# EAGLE design gsm (EAGLE 7.5.0)
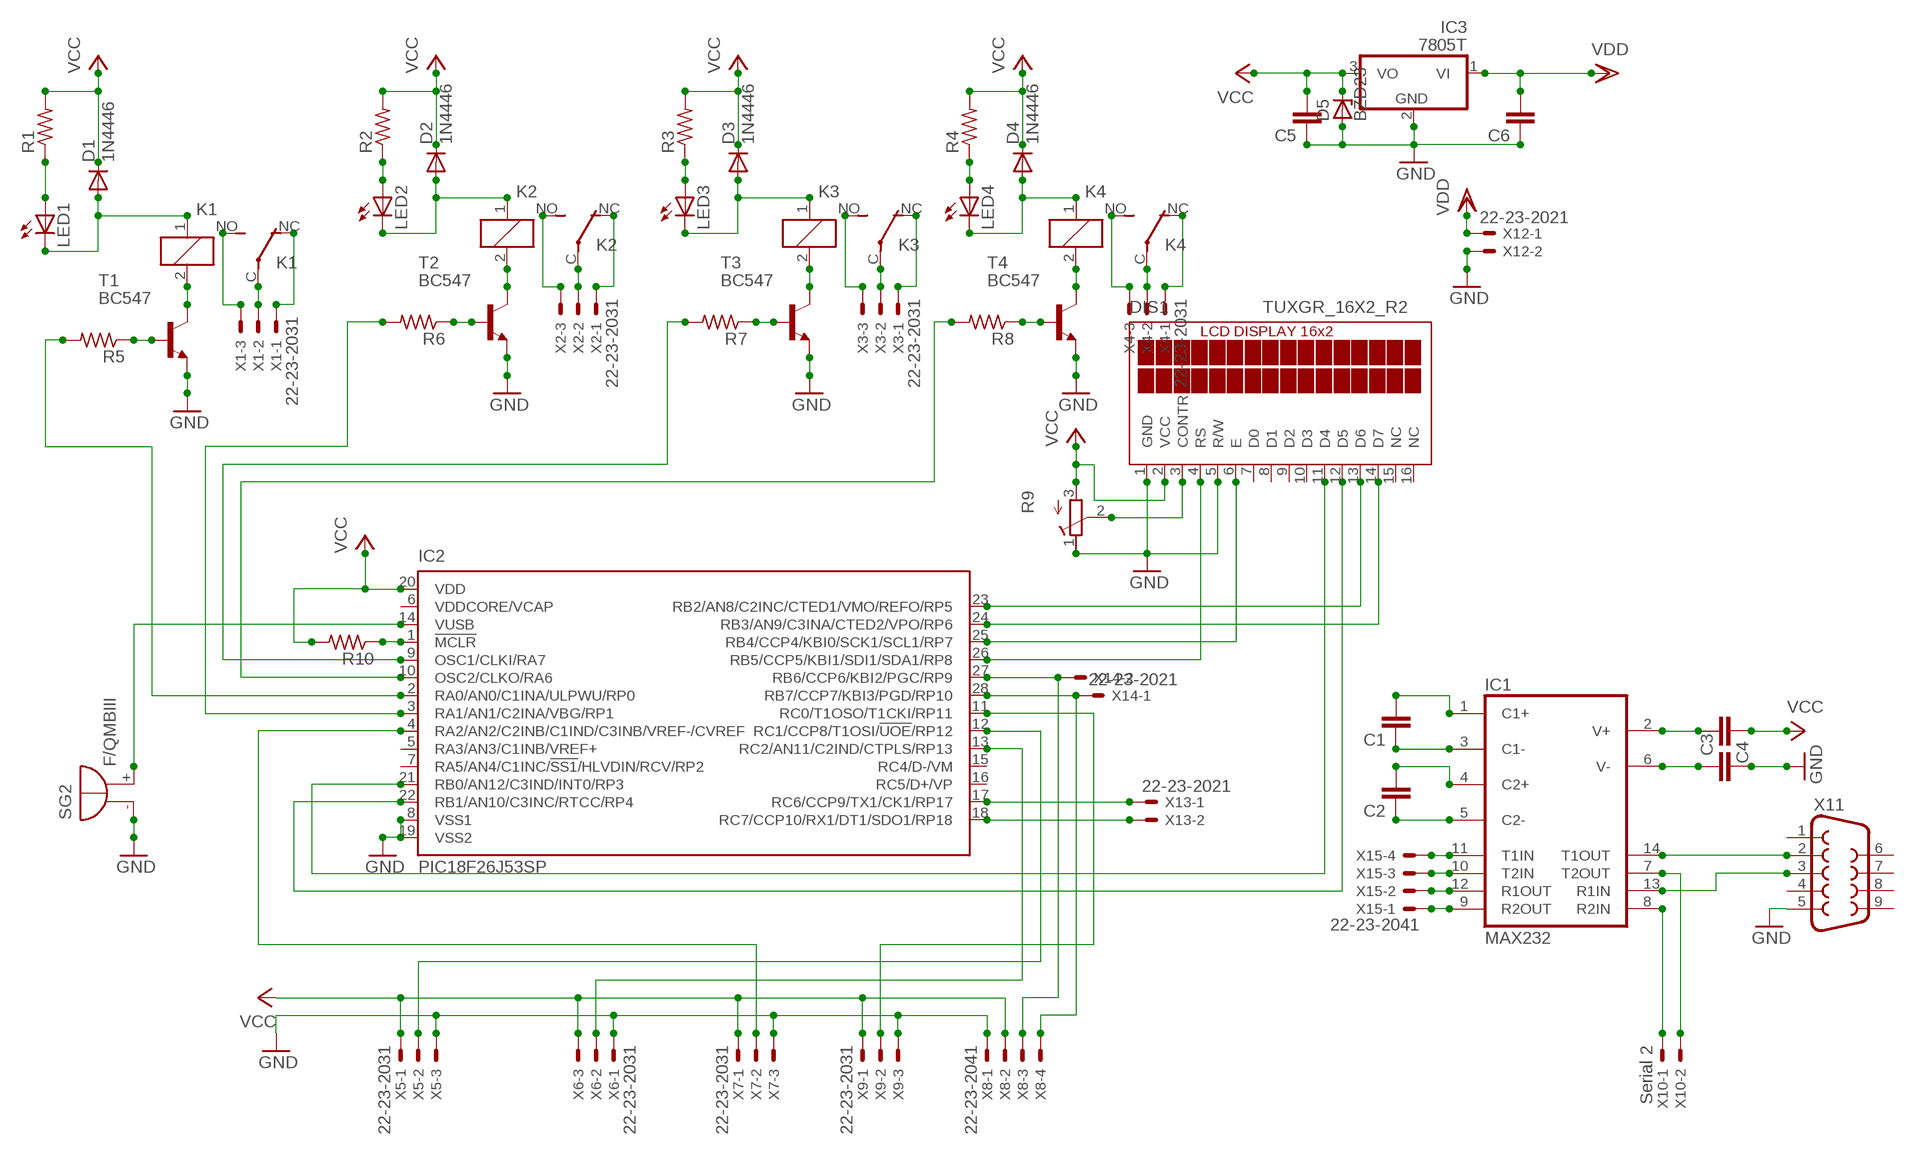
[diagram p0: schematic, sheet 1]

## Parts
C1  C2.5/2  [C2.5-2]
C2  C2.5/2  [C2.5-2]
C3  C2.5/2  [C2.5-2]
C4  C2.5/2  [C2.5-2]
C5  C2.5/2  [C2.5-2]
C6  C2.5/2  [C2.5-2]
D1  1N4446  [DO35-10]
D2  1N4446  [DO35-10]
D3  1N4446  [DO35-10]
D4  1N4446  [DO35-10]
D5  BZD23  [SOD81]
DIS1  TUXGR_16X2_R2  [TUXGR_16X2_R2]
IC1  MAX232  [DIL16]
IC2  PIC18F26J53SP  [DIL28-3]
IC3  7805T  [TO220H]
K1  JJM1-12V  [JJM1C]
K2  JJM1-12V  [JJM1C]
K3  JJM1-12V  [JJM1C]
K4  JJM1-12V  [JJM1C]
LED1  LED3MM  [LED3MM]
LED2  LED3MM  [LED3MM]
LED3  LED3MM  [LED3MM]
LED4  LED3MM  [LED3MM]
R1  R-US_0207/10  [0207/10]
R2  R-US_0207/10  [0207/10]
R3  R-US_0207/10  [0207/10]
R4  R-US_0207/10  [0207/10]
R5  R-US_0207/10  [0207/10]
R6  R-US_0207/10  [0207/10]
R7  R-US_0207/10  [0207/10]
R8  R-US_0207/10  [0207/10]
R9  R-TRIMMT93YA  [RTRIMT93YA]
R10  R-US_0207/10  [0207/10]
SG2  F/QMBIII  [F/QMBIII]
T1  BC547  [TO92]
T2  BC547  [TO92]
T3  BC547  [TO92]
T4  BC547  [TO92]
X1  22-23-2031  [22-23-2031]
X2  22-23-2031  [22-23-2031]
X3  22-23-2031  [22-23-2031]
X4  22-23-2031  [22-23-2031]
X5  22-23-2031  [22-23-2031]
X6  22-23-2031  [22-23-2031]
X7  22-23-2031  [22-23-2031]
X8  22-23-2041  [22-23-2041]
X9  22-23-2031  [22-23-2031]
X10  Serial 2  22-23-2021  [22-23-2021]
X11  F09H  [F09H]
X12  22-23-2021  [22-23-2021]
X13  22-23-2021  [22-23-2021]
X14  22-23-2021  [22-23-2021]
X15  22-23-2041  [22-23-2041]

## Nets
FIRERELAY: IC2.2(RA0/AN0/C1INA/ULPWU/RP0) R5.2
GND: C3.2 C5.1 C6.1 D5.A DIS1.1(GND) DIS1.5(R/W) IC2.8(VSS1) IC2.19(VSS2) IC3.2(GND) R9.1(E) SG2.-(+) T1.1(E) T2.1(E) T3.1(E) T4.1(E) X5.3 X6.1 X7.3 X8.1 X9.3 X11.5 X12.2
N$1: K4.NC(2:O) X4.1
N$2: LED1.A R1.1
N$3: D1.A K1.1 LED1.K(C)
N$4: K4.C(2:P) X4.2
N$5: LED2.A R2.1
N$6: D2.A K2.1 LED2.K(C)
N$7: K4.NO(2:S) X4.3
N$8: LED3.A R3.1
N$9: D3.A K3.1 LED3.K(C)
N$10: K3.NC(2:O) X3.1
N$11: LED4.A R4.1
N$12: D4.A K4.1 LED4.K(C)
N$13: K1.2 T1.3(C)
N$14: K2.2 T2.3(C)
N$15: K3.2 T3.3(C)
N$16: K4.2 T4.3(C)
N$17: R5.1 T1.2(B)
N$18: R6.1 T2.2(B)
N$19: R7.1 T3.2(B)
N$20: R8.1 T4.2(B)
N$21: IC2.3(RA1/AN1/C2INA/VBG/RP1) R6.2
N$22: IC2.9(OSC1/CLKI/RA7) R7.2
N$23: IC2.10(OSC2/CLKO/RA6) R8.2
N$24: DIS1.14(D7) IC2.24(RB3/AN9/C3INA/CTED2/VPO/RP6)
N$25: DIS1.13(D6) IC2.23(RB2/AN8/C2INC/CTED1/VMO/REFO/RP5)
N$26: DIS1.12(D5) IC2.22(RB1/AN10/C3INC/RTCC/RP4)
N$27: DIS1.11(D4) IC2.21(RB0/AN12/C3IND/INT0/RP3)
N$28: DIS1.6(E) IC2.25(RB4/CCP4/KBI0/SCK1/SCL1/RP7)
N$29: DIS1.4(RS) IC2.26(RB5/CCP5/KBI1/SDI1/SDA1/RP8)
N$30: DIS1.3(CONTR) R9.2(S)
N$31: K3.C(2:P) X3.2
N$32: K3.NO(2:S) X3.3
N$33: K2.C(2:P) X2.2
N$34: K2.NC(2:O) X2.1
N$35: K2.NO(2:S) X2.3
N$36: K1.C(2:P) X1.2
N$37: K1.NC(2:O) X1.1
N$38: K1.NO(2:S) X1.3
N$39: C1.2 IC1.1(C1+)
N$40: C1.1 IC1.3(C1-)
N$41: C2.2 IC1.4(C2+)
N$42: C2.1 IC1.5(C2-)
N$43: C4.2 IC1.2(V+)
N$44: C3.1 IC1.6(V-)
N$45: IC2.17(RC6/CCP9/TX1/CK1/RP17) X13.1
N$46: IC1.10(T2IN) X15.3
N$47: IC2.12(RC1/CCP8/T1OSI/!UOE!/RP12) X5.2
N$48: IC2.13(RC2/AN11/C2IND/CTPLS/RP13) X6.2
N$49: IC2.4(RA2/AN2/C2INB/C1IND/C3INB/VREF-/CVREF) X7.2
N$50: IC1.11(T1IN) X15.4
N$51: IC1.12(R1OUT) X15.2
N$52: IC2.27(RB6/CCP6/KBI2/PGC/RP9) X8.3 X14.2
N$53: IC2.1(!MCLR) R10.1
N$54: IC2.11(RC0/T1OSO/T1CKI/RP11) X9.2
N$55: IC2.14(VUSB) SG2.+(-)
N$56: IC2.28(RB7/CCP7/KBI3/PGD/RP10) X8.4 X14.1
N$61: IC1.13(R1IN) X11.3
N$62: IC1.14(T1OUT) X11.2
N$63: IC1.7(T2OUT) X10.2
N$64: IC1.8(R2IN) X10.1
N$66: IC2.18(RC7/CCP10/RX1/DT1/SDO1/RP18) X13.2
N$67: IC1.9(R2OUT) X15.1
VCC: C4.1 C5.2 D1.C D2.C D3.C D4.C D5.C DIS1.2(VCC) IC2.20(VDD) IC3.3(VO) R1.2 R2.2 R3.2 R4.2 R9.3(A) R10.2 X5.1 X6.3 X7.1 X8.2 X9.1
VDD: C6.2 IC3.1(VI) X12.1
Unconnected: DIS1.7(D0) DIS1.8(D1) DIS1.9(D2) DIS1.10(D3) DIS1.15(NC) DIS1.16(NC) IC2.5(RA3/AN3/C1INB/VREF+) IC2.6(VDDCORE/VCAP) IC2.7(RA5/AN4/C1INC/!SS1!/HLVDIN/RCV/RP2) IC2.15(RC4/D-/VM) IC2.16(RC5/D+/VP) X11.1 X11.4 X11.6 X11.7 X11.8 X11.9

## Power pins joined to a net without a drawn wire
GND: IC1.15(GND)
VCC: IC1.16(VCC)

## Library data of the parts
C1-C6 = capacitor-wima:C: CAPACITOR naming: grid - package width
D1-D4 = diode:1N4446: DIODE high speed (Philips)
D5 = diode:BZD23: Z DIODE
DIS1 = display-lcd:TUXGR_16X2_R2: Tuxgraphics LCD display 16x2 characters reflective, without background light Source: tuxgr_12x2_r2.pdf; OC_FARNELL: unknown; OC_NEWARK: unknown
IC1 = maxim:MAX232: RS232 TRANSEIVER; MF: MAXIM; MPN: MAX232ACPE+; OC_FARNELL: 9723773; OC_NEWARK: 68K4544
IC2 = microchip:PIC18F2*J53: PIC18F47J53 Family High-Performance USB Microcontrollers with nanoWatt XLP Technology Source: Data sheet <http://ww1.microchip.com/downloads/en/DeviceDoc/39964B.pdf>; MPN: PIC18F26J53-I/SP; OC_FARNELL: unknown; OC_NEWARK: 63R7831
IC3 = linear:78*: Positive VOLTAGE REGULATOR Source: http://cache.national.com/ds/LM/LM78L05.pdf http://www.fairchildsemi.com/ds/LM/LM7805.pdf
K1-K4 = relay:JJM1-12V: HALF-SIZE AUTOMOTIVE RELAY NAiS Source: http://www.mew-europe.com/.. en_ds_61210_0001.pdf; MF: AROMAT/ MATSUSHITA; MPN: JJM1-12V; OC_FARNELL: unknown; OC_NEWARK: 10C7318
LED1-LED4 = led:LED: LED OSRAM: - CHIPLED LG R971, LG N971, LY N971, LG Q971, LY Q971, LO R971, LY R971 LH N974, LH R974 LS Q976, LO Q976, LY Q976 LO Q996 - Hyper CHIPLED LW Q18S LB Q993, LB Q99A, LB R99A - SideLED LS A670, LO A670, LY A670, LG A670, LP A670 LB A673, LV A673, LT A673, LW A673 LH A674 LY A675 LS A676, LA A676, LO A676, LY A676, LW A676 LS A679, LY A679, LG A679 - Hyper Micro SIDELED® LS Y876, LA Y876, LO Y876, LY Y876 LT Y87S - SmartLED LW L88C, LW L88S LB L89C, LB L89S, LG L890 LS L89K, LO L89K, LY L89K LS L896, LA L896, LO L896, LY L896 - TOPLED LS T670, LO T670, LY T670, LG T670, LP T670 LSG T670, LSP T670, LSY T670, LOP T670, LYG T670 LG T671, LOG T671, LSG T671 LB T673, LV T673, LT T673, LW T673 LH T674 LS T676, LA T676, LO T676, LY T676, LB T676, LH T676, LSB T676, LW T676 LB T67C, LV T67C, LT T67C, LS T67K, LO T67K, LY T67K, LW E67C LS E67B, LA E67B, LO E67B, LY E67B, LB E67C, LV E67C, LT E67C LW T67C LS T679, LY T679, LG T679 LS T770, LO T770, LY T770, LG T770, LP T770 LB T773, LV T773, LT T773, LW T773 LH T774 LS E675, LA E675, LY E675, LS T675 LS T776, LA T776, LO T776, LY T776, LB T776 LHGB T686 LT T68C, LB T68C - Hyper Mini TOPLED® LB M676 - Mini TOPLED Santana® LG M470 LS M47K, LO M47K, LY M47K Source: http://www.osram.convergy.de LUXEON: - LUMILED® LXK2-PW12-R00, LXK2-PW12-S00, LXK2-PW14-U00, LXK2-PW14-V00 LXK2-PM12-R00, LXK2-PM12-S00, LXK2-PM14-U00 LXK2-PE12-Q00, LXK2-PE12-R00, LXK2-PE12-S00, LXK2-PE14-T00, LXK2-PE14-U00 LXK2-PB12-K00, LXK2-PB12-L00, LXK2-PB12-M00, LXK2-PB14-N00, LXK2-PB14-P00, LXK2-PB14-Q00 LXK2-PR12-L00, LXK2-PR12-M00, LXK2-PR14-Q00, LXK2-PR14-R00 LXK2-PD12-Q00, LXK2-PD12-R00, LXK2-PD12-S00 LXK2-PH12-R00, LXK2-PH12-S00 LXK2-PL12-P00, LXK2-PL12-Q00, LXK2-PL12-R00 Source: www.luxeon.com KINGBRIGHT: KA-3528ASYC Source: www.kingbright.com
R1-R8 R10 = rcl:R-US_: RESISTOR, American symbol
R9 = rcl:R-TRIMM: Trimm resistor
SG2 = buzzer:F/QMBIII: BUZZER Source: Buerklin; OC_FARNELL: unknown; OC_NEWARK: unknown
T1-T4 = transistor:BC547: NPN TRANSISTOR
X1-X7 X9 = con-molex:22-23-2031: .100" (2.54mm) Center Header - 3 Pin; MF: MOLEX; MPN: 22-23-2031; OC_FARNELL: 1462950; OC_NEWARK: 30C0862
X8 X15 = con-molex:22-23-2041: .100" (2.54mm) Center Header - 4 Pin; MF: MOLEX; MPN: 22-23-2041; OC_FARNELL: 1462920; OC_NEWARK: 38C0355
X10 X12-X14 = con-molex:22-23-2021: .100" (2.54mm) Center Header - 2 Pin; MF: MOLEX; MPN: 22-23-2021; OC_FARNELL: 1462926; OC_NEWARK: 25C3832
X11 = con-subd:F09: SUB-D; OC_FARNELL: unknown; OC_NEWARK: unknown

## Board
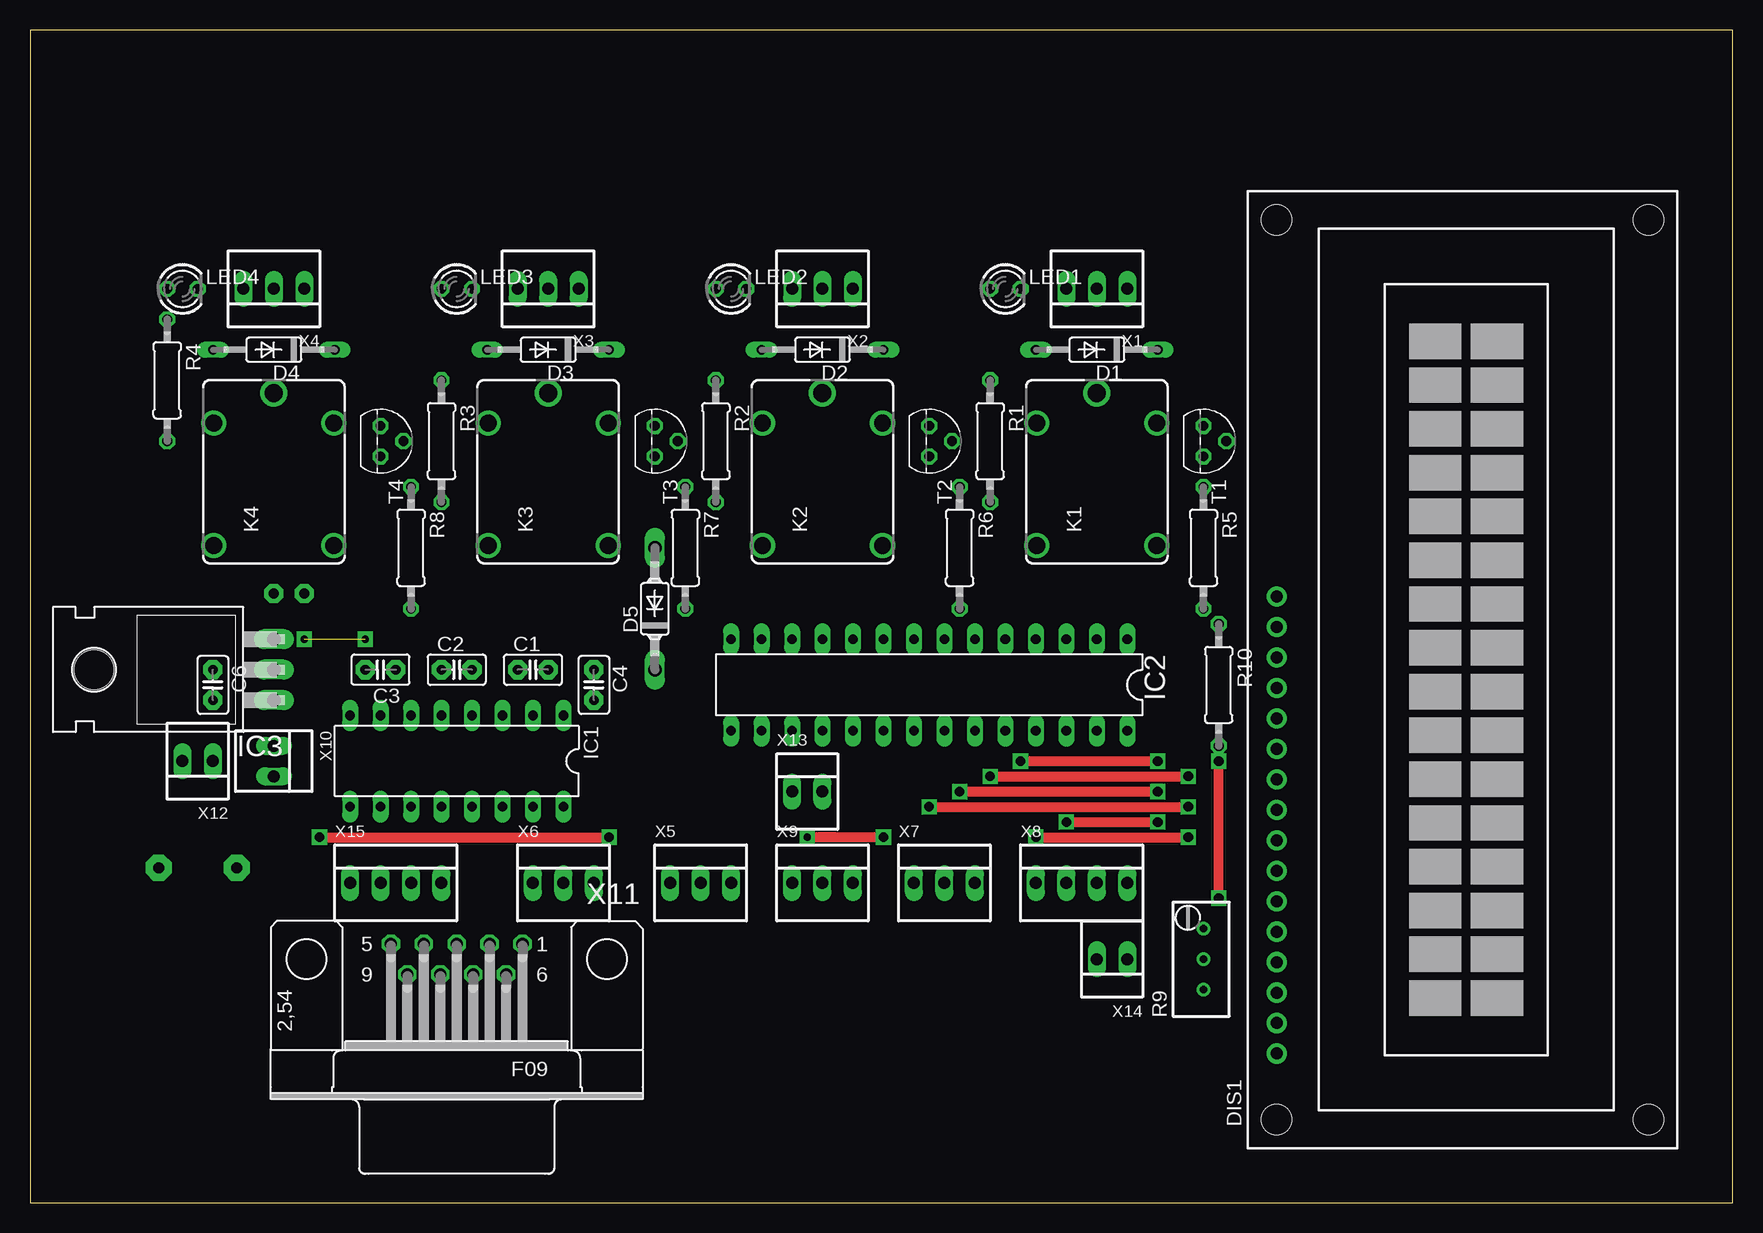
[diagram p1: board, top side]
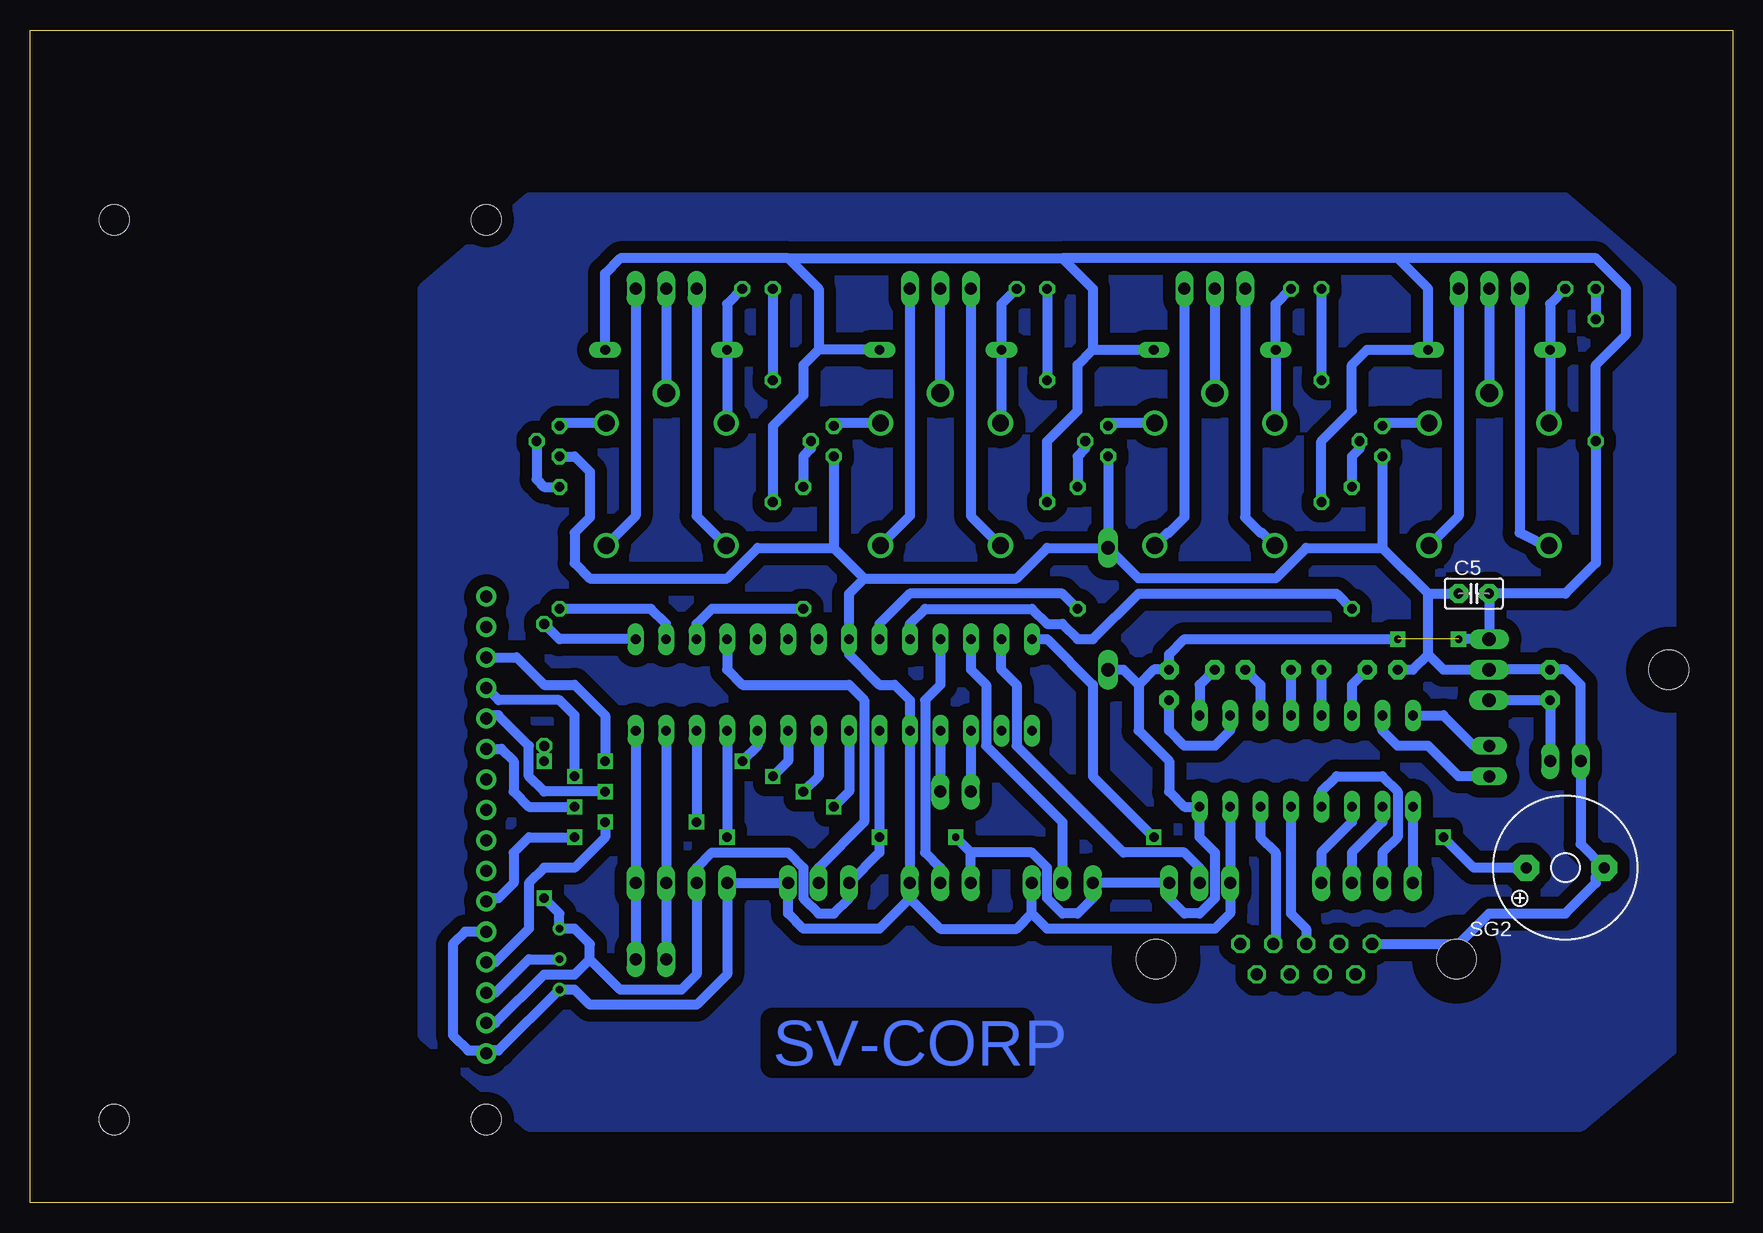
[diagram p2: board, bottom side, seen from below]

Size 141.91 x 97.78 mm. Coordinates in mm from the lower left corner, seen from the top.
Outline: 0,0 141.91,0 141.91,97.78 0,97.78 0,0
Copper layers (1*16): Top 0.035mm / dielectric 1.5mm / Bottom 0.035mm
Design rules "default": minimum track width 10mil, minimum drill 24mil, track to track 8mil, track to pad 8mil, pad to pad 8mil, via to via 8mil, smd to smd 8mil, copper to edge 40mil, drill to drill 8mil, minimum pad ring 10mil, minimum via ring 8mil, stop-mask expansion 4mil, vias tented up to drill 0mil, thermal gap 10mil

### Footprints (pad centres in the part's own frame; a part is rotated, then mirrored left to right if it is on the bottom)
C2.5-2 = drill 0.813 pad 1.6 octagon: 1 -1.27,0; 2 1.27,0
DO35-10 = drill 0.813 long: A 5.08,0; C -5.08,0
SOD81 = drill 1.118 long: A 5.08,0; C -5.08,0
TUXGR_16X2_R2 = drill 1 pad 1.676: 1 -32,15.5; 2 -29.46,15.5; 3 -26.92,15.5; 4 -24.38,15.5; 5 -21.84,15.5; 6 -19.3,15.5; 7 -16.76,15.5; 8 -14.22,15.5; 9 -11.68,15.5; 10 -9.14,15.5; 11 -6.6,15.5; 12 -4.06,15.5; 13 -1.52,15.5; 14 1.02,15.5; 15 3.56,15.5; 16 6.1,15.5 | hole 2.5: -37.5,-15.5; 37.5,-15.5; -37.5,15.5; 37.5,15.5
DIL16 = drill 0.813 long: 1 -8.89,-3.81; 2 -6.35,-3.81; 3 -3.81,-3.81; 4 -1.27,-3.81; 5 1.27,-3.81; 6 3.81,-3.81; 7 6.35,-3.81; 8 8.89,-3.81; 9 8.89,3.81; 10 6.35,3.81; 11 3.81,3.81; 12 1.27,3.81; 13 -1.27,3.81; 14 -3.81,3.81; 15 -6.35,3.81; 16 -8.89,3.81
DIL28-3 = drill 0.813 long: 1 -16.51,-3.81; 2 -13.97,-3.81; 3 -11.43,-3.81; 4 -8.89,-3.81; 5 -6.35,-3.81; 6 -3.81,-3.81; 7 -1.27,-3.81; 8 1.27,-3.81; 9 3.81,-3.81; 10 6.35,-3.81; 11 8.89,-3.81; 12 11.43,-3.81; 13 13.97,-3.81; 14 16.51,-3.81; 15 16.51,3.81; 16 13.97,3.81; 17 11.43,3.81; 18 8.89,3.81; 19 6.35,3.81; 20 3.81,3.81; 21 1.27,3.81; 22 -1.27,3.81; 23 -3.81,3.81; 24 -6.35,3.81; 25 -8.89,3.81; 26 -11.43,3.81; 27 -13.97,3.81; 28 -16.51,3.81
TO220H = drill 1.118 long: 1 -2.54,-10.16; 2 0,-10.16; 3 2.54,-10.16 | hole 3.302: 0,4.826
JJM1C = drill 1.4: 1 4.05,5; 2 4.05,-5; NC -6.15,-5; NO -6.15,5 | drill 1.5: C 6.55,0
LED3MM = drill 0.813 octagon: A -1.27,0; K 1.27,0
0207/10 = drill 0.813 octagon: 1 -5.08,0; 2 5.08,0
RTRIMT93YA = drill 0.61: 1 0,-2.54; 2 0,0; 3 0,2.54
F/QMBIII = drill 0.914 pad 2.159 octagon: + 3.251,0; - -3.251,0
TO92 = drill 0.813 octagon: 1 1.27,0; 2 0,1.905; 3 -1.27,0
22-23-2031 = drill 1 long: 1 -2.54,0; 2 0,0; 3 2.54,0
22-23-2041 = drill 1 long: 1 -3.81,0; 2 -1.27,0; 3 1.27,0; 4 3.81,0
22-23-2021 = drill 1 long: 1 -1.27,0; 2 1.27,0
F09H = drill 1.016 octagon: 1 -5.486,-1.27; 2 -2.743,-1.27; 3 0,-1.27; 4 2.743,-1.27; 5 5.486,-1.27; 6 -4.115,1.27; 7 -1.372,1.27; 8 1.372,1.27; 9 4.115,1.27 | hole 3.302: -12.522,0; 12.522,0

### Placement (x,y rotation side)
C1  41.91,44.45 0 top
C2  35.56,44.45 0 top
C3  29.21,44.45 180 top
C4  46.99,43.18 270 top
C5  21.59,50.8 0 bottom
C6  15.24,43.18 270 top
D1  88.9,71.12 180 top
D2  66.04,71.12 180 top
D3  43.18,71.12 180 top
D4  20.32,71.12 180 top
D5  52.07,49.53 90 top
DIS1  119.38,44.45 90 top
IC1  35.56,36.83 180 top
IC2  74.93,43.18 180 top
IC3  10.16,44.45 90 top
K1  88.9,60.96 90 top
K2  66.04,60.96 90 top
K3  43.18,60.96 90 top
K4  20.32,60.96 90 top
LED1  81.28,76.2 0 top
LED2  58.42,76.2 0 top
LED3  35.56,76.2 0 top
LED4  12.7,76.2 0 top
R1  80.01,63.5 270 top
R2  57.15,63.5 270 top
R3  34.29,63.5 270 top
R4  11.43,68.58 270 top
R5  97.79,54.61 270 top
R6  77.47,54.61 270 top
R7  54.61,54.61 270 top
R8  31.75,54.61 270 top
R9  97.79,20.32 0 top
R10  99.06,43.18 270 top
SG2  13.97,27.94 180 bottom
T1  97.79,63.5 270 top
T2  74.93,63.5 270 top
T3  52.07,63.5 270 top
T4  29.21,63.5 270 top
X1  88.9,76.2 180 top
X2  66.04,76.2 180 top
X3  43.18,76.2 180 top
X4  20.32,76.2 180 top
X5  55.88,26.67 0 top
X6  44.45,26.67 0 top
X7  76.2,26.67 0 top
X8  87.63,26.67 0 top
X9  66.04,26.67 0 top
X10  20.32,36.83 270 top
X11  35.56,20.32 180 top
X12  13.97,36.83 180 top
X13  64.77,34.29 0 top
X14  90.17,20.32 180 top
X15  30.48,26.67 0 top

### Tracks (layer width: path | path; a pad name or v marks a point on that pad's centre or on a via)
FIRERELAY
  Bottom 0.813: IC2.2 88.9,48.26 90.17,49.53 R5.2
GND
  Bottom 0.813: T4.1 29.21,54.61 | 29.21,54.61 25.4,50.8 | 25.4,50.8 C5.1 | T3.1 D5.A | 29.21,54.61 35.56,54.61 38.1,52.07 49.53,52.07 D5.A | T2.1 74.93,54.61 | 74.93,54.61 72.39,52.07 | 72.39,52.07 59.69,52.07 57.15,54.61 D5.A | T1.1 96.52,62.23 95.25,60.96 95.25,57.15 96.52,55.88 96.52,53.34 95.25,52.07 83.82,52.07 81.28,54.61 74.93,54.61 | 25.4,45.72 24.13,44.45 IC3.2 C6.1 13.97,44.45 12.7,43.18 X12.2 12.7,29.92 SG2.- 11.43,27.23 11.43,26.67 13.97,24.13 20.32,24.13 22.86,21.59 X11.5 30.07,22 | 25.4,45.72 25.4,50.8 | C3.2 26.67,44.45 25.4,45.72 | DIS1.5 105.66,22.61 106.68,21.59 106.68,13.97 105.41,12.7 104.13,12.7 DIS1.1 103.63,12.7 102.87,12.7 R9.1 96.52,17.78 95.25,16.51 86.36,16.51 83.82,19.05 X8.1 X7.3 78.74,24.13 77.47,22.86 71.12,22.86 68.58,25.4 | 72.39,52.07 73.66,50.8 IC2.8 73.66,45.72 71.12,43.18 69.85,43.18 68.58,41.91 IC2.19 X9.3 68.58,25.4 | 68.58,25.4 66.04,22.86 59.69,22.86 58.42,24.13 | 58.42,24.13 X5.3 | IC1.15 X6.1 41.91,24.13 43.18,22.86 57.15,22.86 58.42,24.13
N$1
  Bottom 0.813: X4.1 22.86,57.27 K4.NC
N$2
  Bottom 0.813: LED1.A R1.1
N$3
  Bottom 0.813: LED1.K 83.82,74.93 D1.A 83.82,65.09 K1.1
N$4
  Bottom 0.813: X4.2 K4.C
N$5
  Bottom 0.813: LED2.A R2.1
N$6
  Bottom 0.813: LED2.K 60.96,74.93 D2.A 60.96,65.09 K2.1
N$7
  Bottom 0.813: X4.3 17.78,55.88 15.24,54.61 15.52,54.61 K4.NO
N$8
  Bottom 0.813: LED3.A R3.1
N$9
  Bottom 0.813: LED3.K 38.1,74.93 D3.A 38.1,65.09 K3.1
N$10
  Bottom 0.813: X3.1 45.72,57.15 46.99,55.88 47.11,55.88 K3.NC
N$11
  Bottom 0.813: LED4.A R4.1
N$12
  Bottom 0.813: K4.1 15.24,65.09 D4.A 15.24,74.93 LED4.K
N$13
  Bottom 0.813: K1.2 97.55,65.01 T1.3
N$14
  Bottom 0.813: K2.2 74.69,65.01 T2.3
N$15
  Bottom 0.813: K3.2 51.83,65.01 T3.3
N$16
  Bottom 0.813: K4.2 28.97,65.01 T4.3
N$17
  Bottom 0.813: T1.2 99.69,60.33 99.06,59.69 R5.1
N$18
  Bottom 0.813: T2.2 76.83,62.87 77.47,62.23 R6.1
N$19
  Bottom 0.813: T3.2 53.98,62.87 54.61,62.23 R7.1
N$20
  Bottom 0.813: T4.2 31.11,62.87 31.75,62.23 R8.1
N$21
  Bottom 0.813: R6.2 85.09,49.53 86.36,48.26 IC2.3
N$22
  Bottom 0.813: IC2.9 71.12,48.26 68.58,50.8 55.88,50.8 R7.2
N$23
  Bottom 0.813: IC2.10 68.58,48.26 67.31,49.53 58.42,49.53 57.15,48.26 55.88,48.26 54.61,46.99 53.34,46.99 49.53,50.8 33.02,50.8 R8.2
N$24  (via drill 0.8 pad 1.27)
  Top 0.813: v82.55,36.83 v93.98,36.83
  Bottom 0.813: DIS1.14 101.35,45.47 99.06,43.18 96.52,43.18 93.98,40.64 v93.98,36.83 | IC2.24 81.28,38.1 v82.55,36.83
N$25  (via drill 0.8 pad 1.27)
  Top 0.813: v80.01,35.56 v96.52,35.56
  Bottom 0.813: IC2.23 78.74,36.83 v80.01,35.56 | v96.52,35.56 96.52,40.64 97.79,41.91 102.86,41.91 DIS1.13
N$26  (via drill 0.8 pad 1.27)
  Top 0.813: v77.47,34.29 v93.98,34.29
  Bottom 0.813: IC2.22 76.2,35.56 v77.47,34.29 | v93.98,34.29 99.06,34.29 100.33,35.56 100.33,38.1 102.87,40.64 103.63,40.64 DIS1.12
N$27  (via drill 0.8 pad 1.27)
  Top 0.813: v74.93,33.02 v96.52,33.02
  Bottom 0.813: DIS1.11 102.62,37.85 101.6,36.83 101.6,34.29 100.33,33.02 v96.52,33.02 | IC2.21 73.66,34.29 v74.93,33.02
N$28  (via drill 0.8 pad 1.27)
  Top 0.813: v83.82,30.48 v96.52,30.48
  Bottom 0.813: IC2.25 v83.82,30.48 | DIS1.6 103.63,25.4 102.87,25.4 101.6,26.67 101.6,29.21 100.33,30.48 v96.52,30.48
N$29  (via drill 0.8 pad 1.27)
  Top 0.813: v86.36,31.75 v93.98,31.75
  Bottom 0.813: IC2.26 v86.36,31.75 | DIS1.4 103.12,20.07 100.33,22.86 100.33,26.67 99.06,27.94 96.52,27.94 93.98,30.48 v93.98,31.75
N$30
  Bottom 0.813: DIS1.3 103.12,17.53 100.33,20.32 R9.2
N$31
  Bottom 0.813: X3.2 K3.C
N$32
  Bottom 0.813: X3.3 40.64,57.15 39.37,55.88 39.25,55.88 K3.NO
N$33
  Bottom 0.813: K2.C X2.2
N$34
  Bottom 0.813: X2.1 68.58,57.27 K2.NC
N$35
  Bottom 0.813: X2.3 63.5,57.27 K2.NO
N$36
  Bottom 0.813: X1.2 K1.C
N$37
  Bottom 0.813: X1.1 91.44,57.27 K1.NC
N$38
  Bottom 0.813: X1.3 86.36,57.27 K1.NO
N$39
  Bottom 0.813: C1.2 44.45,43.18 IC1.1
N$40
  Bottom 0.813: C1.1 39.37,43.18 IC1.3
N$41
  Bottom 0.813: C2.2 IC1.4
N$42
  Bottom 0.813: C2.1 IC1.5
N$43
  Bottom 0.813: IC1.2 41.91,39.37 43.18,38.1 45.72,38.1 46.99,39.37 C4.2
N$44
  Bottom 0.813: C3.1 31.75,43.18 IC1.6
N$45
  Bottom 0.813: IC2.17 X13.1
N$46
  Bottom 0.813: IC1.10 29.21,31.75 31.75,29.21 X15.3
N$47
  Bottom 0.813: IC2.12 63.5,44.45 62.23,43.18 62.23,38.1 55.88,31.75 X5.2
N$48
  Bottom 0.813: X6.2 44.45,27.94 45.72,29.21 50.8,29.21 59.69,38.1 59.69,43.18 60.96,44.45 IC2.13
N$49
  Bottom 0.813: IC2.4 83.82,44.45 82.55,43.18 73.66,43.18 72.39,41.91 72.39,31.75 76.2,27.94 X7.2
N$50
  Bottom 0.813: IC1.11 31.75,31.75 34.29,29.21 X15.4
N$51
  Bottom 0.813: IC1.12 34.29,34.29 33.02,35.56 29.21,35.56 27.94,34.29 27.94,30.48 29.21,29.21 X15.2
N$52
  Bottom 0.813: IC2.27 X8.3 X14.2
N$53
  Bottom 0.813: IC2.1 97.79,46.99 R10.1
N$54
  Bottom 0.813: IC2.11 66.04,43.18 67.31,41.91 67.31,29.21 66.04,27.94 X9.2
N$55  (via drill 0.8 pad 1.27)
  Top 0.813: v24.13,30.48 v48.26,30.48
  Bottom 0.813: IC2.14 57.15,46.99 53.34,43.18 53.34,35.56 v48.26,30.48 | v24.13,30.48 21.59,27.94 SG2.+
N$56
  Bottom 0.813: IC2.28 X8.4 X14.1
N$59
  pour Bottom (isolate 1.016): 13.97,83.82 100.33,83.82 109.22,76.2 109.22,13.97 100.33,6.35 12.7,6.35 5.08,12.7 5.08,76.2
N$61
  Bottom 0.813: IC1.13 36.83,24.13 35.56,22.86 X11.3
N$62
  Bottom 0.813: IC1.14 39.37,30.48 38.1,29.21 38.1,21.79 X11.2
N$63
  Bottom 0.813: X10.2 22.86,35.56 25.4,38.1 27.94,38.1 29.21,39.37 IC1.7
N$64
  Bottom 0.813: IC1.8 24.13,40.64 21.59,38.1 X10.1
N$66
  Bottom 0.813: IC2.18 X13.2
N$67
  Bottom 0.813: IC1.9 X15.1
VCC  (via drill 0.6, 0.6 pad 1.27, 0.8 pad 1.27)  (1 unrouted)
  Top 0.813: v99.06,25.4 v99.06,36.83 | v71.12,30.48 v64.77,30.48
  Bottom 0.813: R3.2 34.29,63.5 31.75,66.04 31.75,69.85 30.48,71.12 D4.C 25.4,76.2 27.94,78.74 | R2.2 57.15,63.5 54.61,66.04 54.61,69.85 53.34,71.12 | 53.34,71.12 D3.C | D2.C 76.2,71.12 | 76.2,71.12 77.47,69.85 77.47,67.31 80.01,64.77 R1.2 | D1.C 93.98,77.47 92.71,78.74 78.74,78.74 | 78.74,78.74 76.2,76.2 76.2,71.12 | 78.74,78.74 55.88,78.74 | 55.88,78.74 53.34,76.2 53.34,71.12 | 27.94,78.74 55.88,78.74 | 27.94,78.74 11.43,78.74 8.89,76.2 8.89,72.39 11.43,69.85 R4.2 11.43,53.34 13.97,50.8 C5.2 IC3.3 v22.86,46.99 | v27.94,46.99 45.72,46.99 46.99,45.72 C4.1 48.26,44.45 49.53,43.18 | 49.53,43.18 49.53,39.37 46.99,36.83 46.99,34.29 45.72,33.02 IC1.16 44.45,30.48 43.18,29.21 43.18,25.4 44.45,24.13 45.72,24.13 46.99,25.4 X6.3 X5.1 53.34,25.4 54.61,24.13 55.88,24.13 57.15,25.4 57.15,27.94 58.42,29.21 63.5,29.21 | IC2.20 v71.12,30.48 71.12,29.21 X7.1 73.66,25.4 74.93,24.13 76.2,24.13 77.47,25.4 77.47,27.94 78.74,29.21 85.09,29.21 86.36,27.94 X8.2 86.36,19.05 87.63,17.78 92.71,17.78 95.25,20.32 | R10.2 v99.06,36.83 | DIS1.2 103.12,14.99 99.06,19.05 96.52,19.05 95.25,20.32 | 95.25,20.32 95.25,21.59 96.52,22.86 R9.3 97.79,24.13 v99.06,25.4 | X9.1 63.5,29.21 | 63.5,29.21 v64.77,30.48 | D5.C 50.8,44.45 49.53,43.18
VDD
  Bottom 0.813: IC3.1 C6.2 X12.1

### Text on the board
Bottom: SV-CORP